# EAGLE design encoder_final (EAGLE 6.2)
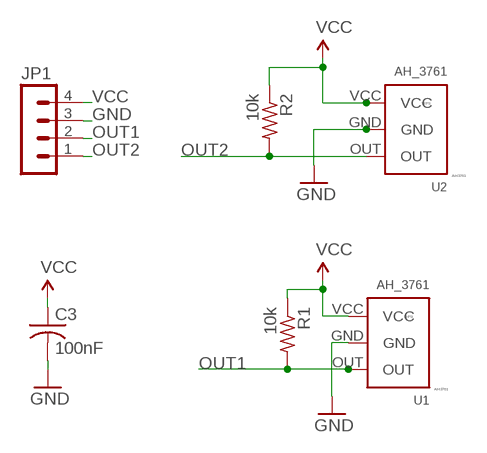
[diagram p0: schematic, sheet 1]

## Parts
C3  100nF  C-USC2012  [C2012]
JP1  MA04-1  [MA04-1]
R1  10k  R-US_R3216  [R3216]
R2  10k  R-US_R3216  [R3216]
U1  AH_3761  [SIP3]
U2  AH_3761  [SIP3]

## Nets
GND: C3.2 JP1.3 U1.GND U2.GND
OUT1: JP1.2 R1.2 U1.OUT
OUT2: JP1.1 R2.2 U2.OUT
VCC: C3.1 JP1.4 R1.1 R2.1 U1.VCC U2.VCC

## Library data of the parts
C3 = resistor:C-US: CAPACITOR, American symbol
JP1 = con-lstb:MA04-1: PIN HEADER; OC_FARNELL: unknown; OC_NEWARK: unknown
R1 R2 = resistor:R-US_: RESISTOR, American symbol
U1 U2 = custom_hall:AH_3761

## Board
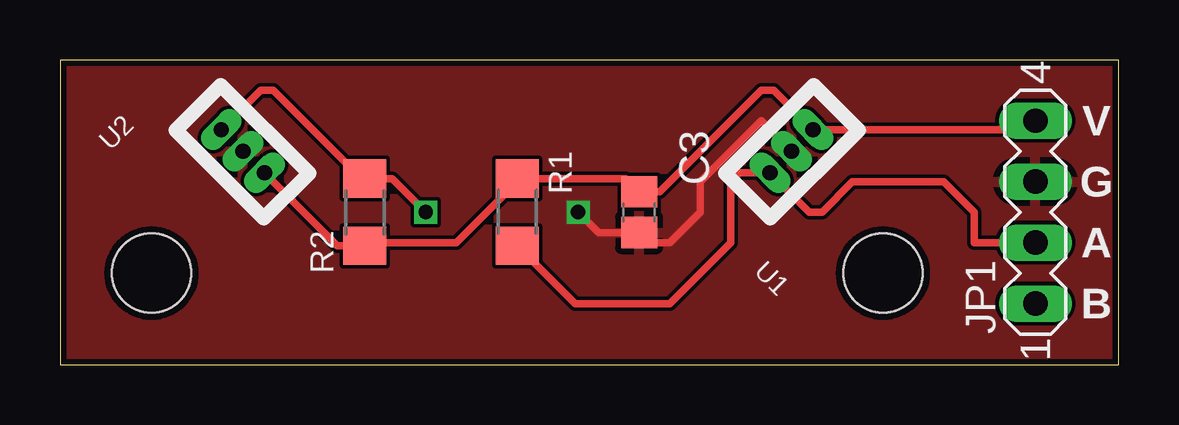
[diagram p1: board, top side]
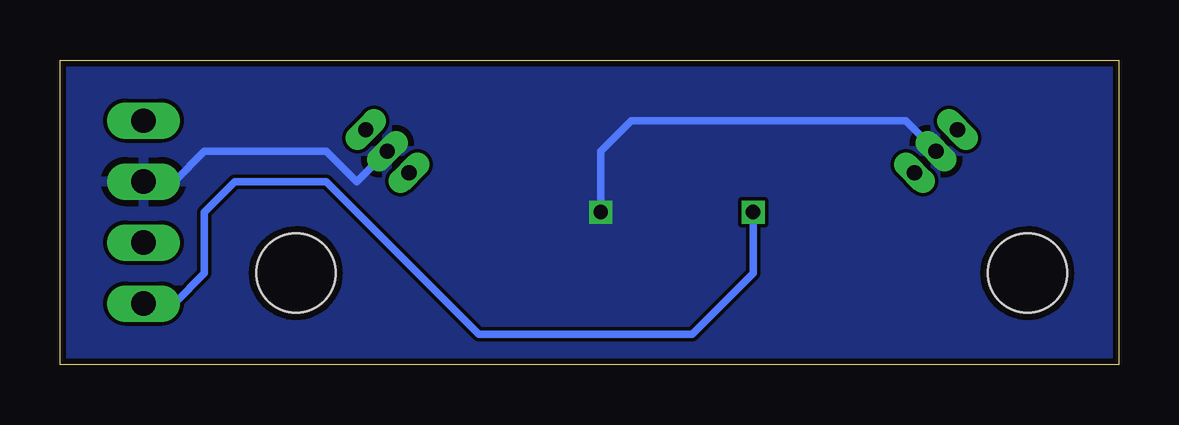
[diagram p2: board, bottom side, seen from below]

Size 44.12 x 12.69 mm. Coordinates in mm from the lower left corner, seen from the top.
Outline: 0,0 44.12,0 44.12,12.69 0,12.69 0,0
Copper layers (1*16): Top 2mil / dielectric 9mil / Bottom 2mil
Design rules: minimum track width 6mil, minimum drill 15mil, track to track 6mil, track to pad 10mil, pad to pad 6mil, via to via 6mil, smd to smd 6mil, copper to edge 10mil, drill to drill 7mil, minimum pad ring 7mil, minimum via ring 7mil, stop-mask expansion 3mil, vias tented up to drill 0mil, thermal gap 10mil

### Footprints (pad centres in the part's own frame; a part is rotated, then mirrored left to right if it is on the bottom)
C2012 = smd 1.3 x 1.5: 1 -0.85,0; 2 0.85,0
STAND-OFF = hole 3.302: 0,0
MA04-1 = drill 1.016 long: 1 -3.81,0; 2 -1.27,0; 3 1.27,0; 4 3.81,0
R3216 = smd 1.6 x 1.8: 1 -1.4,0; 2 1.4,0
SIP3 = drill 0.635 pad 0.7 long: GND 0,0; OUT 0,1.27; VCC 0,-1.27

### Placement (x,y rotation side)
C3  24.13,6.35 270 top
E$1  [STAND-OFF]  34.29,3.81 0 top
E$2  [STAND-OFF]  3.81,3.81 0 top
JP1  40.64,6.35 90 top
R1  19.05,6.35 270 top
R2  12.7,6.35 90 top
U1  30.48,8.89 135 top
U2  7.62,8.89 45 top

### Tracks (layer width: path | path; a pad name or v marks a point on that pad's centre or on a via)
GND  (via drill 0.6)
  Top 0.305: U1.GND 29.21,10.16 26.67,7.62 26.67,6.35 25.4,5.08 24.55,5.08 C3.2 22.44,5.5 v21.59,6.35
  Bottom 0.305: JP1.3 39.37,7.62 38.1,8.89 33.02,8.89 31.75,7.62 U1.GND | v21.59,6.35 21.59,8.89 20.32,10.16 8.89,10.16 U2.GND
  pour Bottom: 0,0 44.45,0 44.45,12.7 0,12.7
  pour Top: 0,12.7 44.45,12.7 44.45,0 0,0
OUT1
  Top 0.305: JP1.2 38.1,5.08 38.1,6.35 36.83,7.62 33.02,7.62 31.75,6.35 31.22,6.35 U1.OUT 28.31,7.99 27.94,7.62 27.94,5.08 25.4,2.54 21.46,2.54 R1.2
OUT2  (via drill 0.6)
  Top 0.305: U2.OUT 8.36,11.43 8.89,11.43 12.57,7.75 R2.2 13.84,7.75 v15.24,6.35 15.11,6.48
  Bottom 0.305: v15.24,6.35 15.24,3.81 17.78,1.27 26.67,1.27 33.02,7.62 36.83,7.62 38.1,6.35 38.1,3.81 39.37,2.54 JP1.1
VCC
  Top 0.305: U2.VCC | U2.VCC 11.56,4.95 R2.1 12.83,5.08 16.51,5.08 19.05,7.62 R1.1 23.58,7.75 C3.1 24.98,7.2 29.21,11.43 29.74,11.43 U1.VCC 40.27,9.79 JP1.4

### Text on the board
tPlace: V | G | A | B